# EasyEDA Pro project 包裹款-触摸屏控制板V1.3.eprj, board PCB
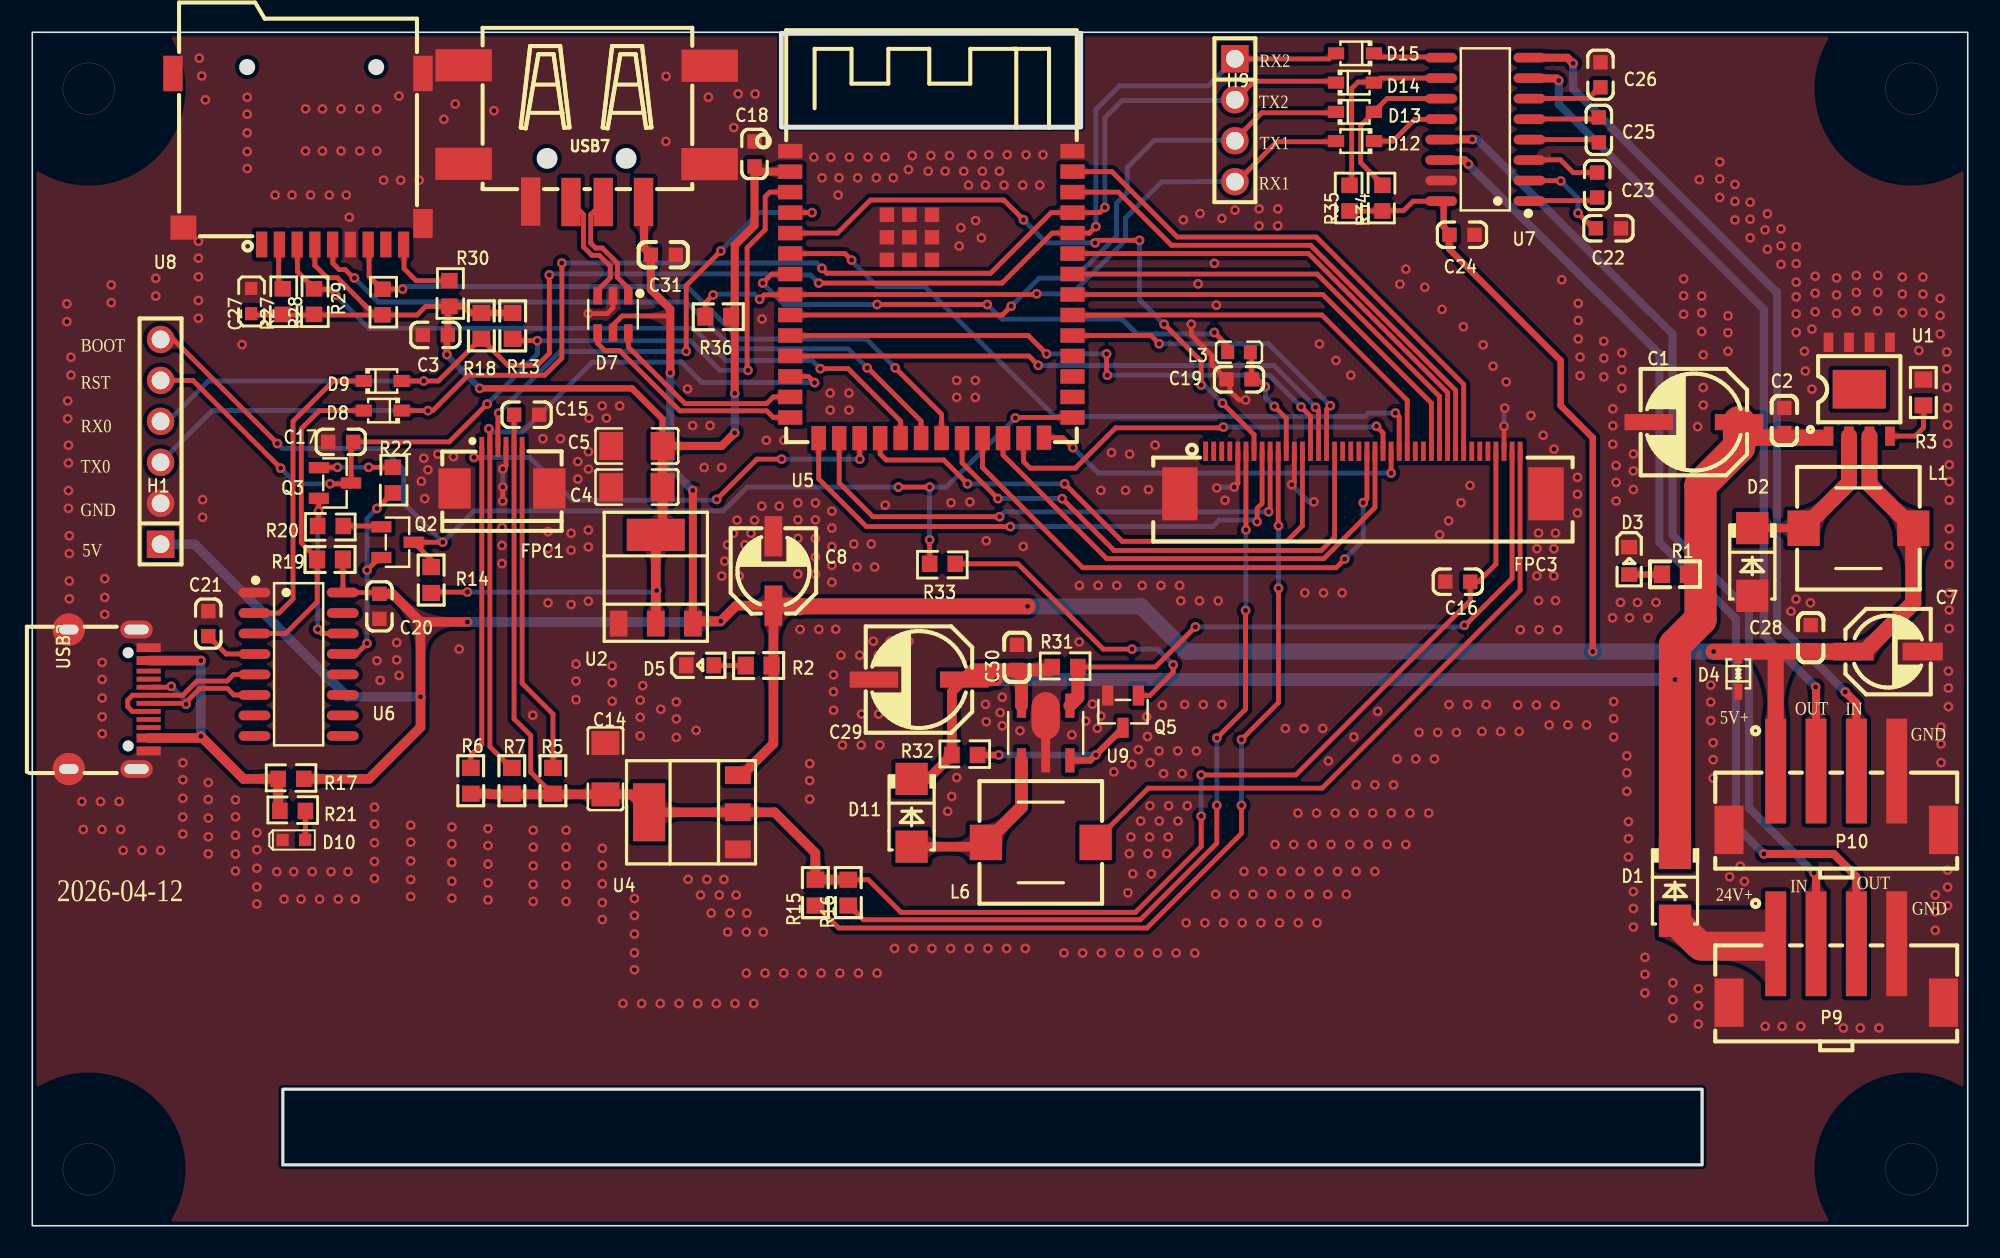
[diagram p1: board, top side]
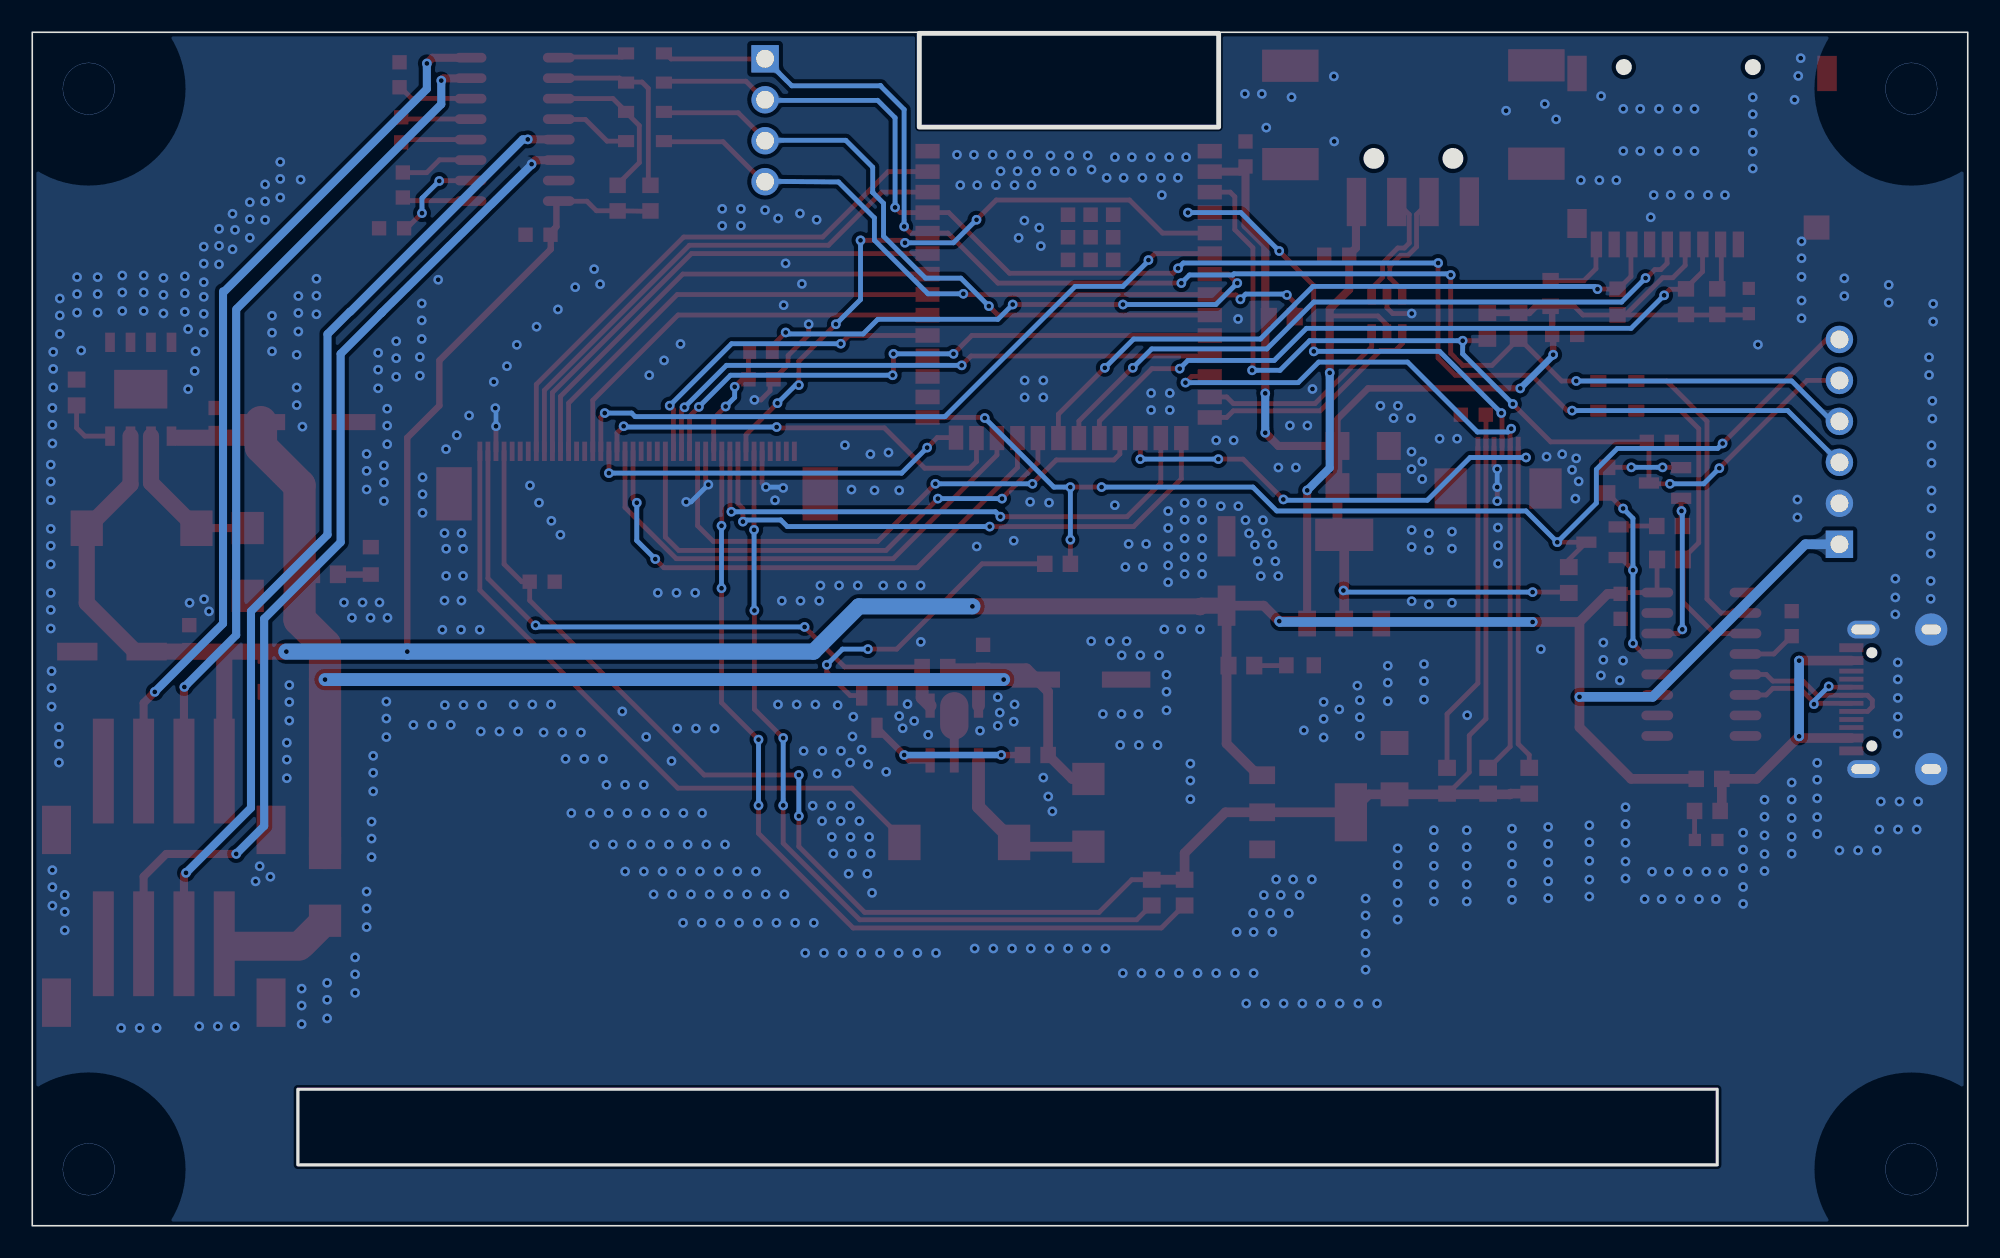
[diagram p2: board, bottom side, seen from below]

Outline 120 x 74 mm; copper layers: Top Layer, Bottom Layer. Coordinates in mm from the lower left corner of the outline.
Outline path: rectangle 0,74 120,0 ; circle c3.5,70.5 r1.6 ; circle c3.5,3.5 r1.6 ; rectangle 15.53,8.47 103.53,3.77 ; rectangle 46.44,73.93 65.01,68.12 ; circle c116.5,70.5 r1.6 ; circle c116.5,3.5 r1.6
Stack: Top Layer 0.035mm / Dielectric1 1.51mm FR4 er 4.5 / Bottom Layer 0.035mm

## Design rules (mm)
net SL_D+: DP3
net SL_D-: DP3
net USB_D+: DP1
net USB_D-: DP1
net D1-: DP2
net D1+: DP2
template: 用户自定义配置
spacing Default (default): track to track 0.152, other pairs 0 to 0.152
track width Default (default): min 0.254, default 0.254, max 25.4
differential pair differentialPair (default): width min 0.127, default 0.254, max 2.54; gap min 0.152, default 0.152
via Default (default): diameter min 0.25, default 0.61, max 100.025; hole min 0.2, default 0.305, max 59.995

## Placement (name value [footprint] x y rotation side)
C1  100uF/35V  [电解电容贴片6X6]  103.02 49.83 180 top
C2  104  [0603C]  108.63 49.93 270 top
C3  104  [0603C]  24.99 55.23 0 top
C4  4.7uF  [C1206]  37.49 45.8 0 top
C5  4.7uF  [C1206]  37.49 48.35 0 top
C7  100uF/10V  [CAP-SMD_BD5.0-L5.3-W5.3-RD]  115.06 35.6 180 top
C8  100uF/10V  [CAP-SMD_BD5.0-L5.3-W5.3-RD]  45.95 40.6 270 top
C14  4.7uF  [C1206]  35.54 28.34 270 top
C15  104  [0603C]  30.65 50.29 180 top
C16  104  [0603C]  88.38 39.93 0 top
C17  104  [0603C]  19.12 48.6 0 top
C18  104  [0603C]  44.78 66.45 270 top
C19  10pF  [0603C]  74.82 52.48 0 top
C20  104  [0603C]  21.52 38.4 270 top
C21  104  [0603C]  10.91 37.33 90 top
C22  104  [0603C]  97.72 61.85 180 top
C23  104  [0603C]  97.02 64.53 270 top
C24  104  [0603C]  88.64 61.45 180 top
C25  104  [0603C]  97.13 67.95 270 top
C26  104  [0603C]  97.23 71.36 90 top
C27  104  [11]  13.87 58.08 90 top
C28  104  [0603C]  110.26 36.47 90 top
C29  100uF/35V  [电解电容贴片6X6]  54.98 33.86 180 top
C30  104  [0603C]  61.05 35.24 90 top
C31  104  [0603C]  39.12 60.21 0 top
D1  SS56  [SMA]  101.85 21.01 270 top
D2  SS56  [SMA]  106.64 41.16 270 top
D3  绿光  [0603LED]  98.99 41.26 90 top
D4  PESD5V0L1BA-N  [SOD-323_L1.8-W1.3-LS2.5-BI]  105.77 34.22 90 top
D5  绿光  [0603LED]  41.36 34.73 180 top
D7  USBLC6-2SC6  [SOT-23-6_L2.9-W1.6-P0.95-LS2.8-BL]  36.01 56.51 180 top
D8  1N4148WS  [SOD-323_L1.8-W1.3-LS2.5-RD]  21.73 50.54 180 top
D9  1N4148WS  [SOD-323_L1.8-W1.3-LS2.5-RD]  21.73 52.38 0 top
D10  LED红  [0603L]  16.22 23.92 180 top
D11  SS56  [SMA]  54.52 25.6 270 top
D12  1N4148WS  [SOD-323_L1.8-W1.3-LS2.5-RD]  82.01 67.25 180 top
D13  1N4148WS  [SOD-323_L1.8-W1.3-LS2.5-RD]  82.01 69.06 0 top
D14  1N4148WS  [SOD-323_L1.8-W1.3-LS2.5-RD]  82.01 70.88 0 top
D15  1N4148WS  [SOD-323_L1.8-W1.3-LS2.5-RD]  82.01 72.69 180 top
FPC1  FPC-05F-6PH20(0.5)  [FPC-SMD_6P-P0.50_XUNPU_FPC-05F-6PH20]  29.12 47 0 top
FPC3  AFC07-S40ECA-00  [FPC-SMD_P0.50-40P_LCS-SJ-H2.0]  82.5 46.7 180 top
H1  PZ254V-11-06P  [HDR-TH_6P-P2.54-V-M]  7.96 48.6 90 top
H9  PZ254V-11-04P  [HDR-TH_4P-P2.54-V-M]  74.56 68.55 270 top
L1  68uH  [IND-SMD_L7.0-W7.0_SMDRI74-330MT]  113.22 43.25 180 top
L3  10uH  [L0603]  74.82 54.16 180 top
L6  68uH  [IND-SMD_L7.0-W7.0_SMDRI74-330MT]  62.53 23.77 0 top
P9  2.54-4PLTDK  [CONN-SMD_4P-P2.50_SHOU_2.54-4PLTDK]  111.84 15.66 0 top
P10  2.54-4PLTDK  [CONN-SMD_4P-P2.50_SHOU_2.54-4PLTDK]  111.84 26.37 0 top
Q2  SS8050  [SOT-23-3_L2.9-W1.3-P1.90-LS2.4-BR]  22.64 42.38 180 top
Q3  SS8050  [SOT-23-3_L2.9-W1.3-P1.90-LS2.4-BR]  18.77 46.05 180 top
Q5  SS8050  [SOT-23-3_L2.9-W1.3-P1.90-LS2.4-BR]  67.63 31.88 90 top
R1  47K  [0603R]  101.85 40.39 0 top
R2  10K  [0603R]  45.03 34.73 0 top
R3  10K  [0603R]  117.25 51.66 90 top
R5  10K  [0603R]  32.28 27.59 90 top
R6  10K  [0603R]  27.19 27.59 90 top
R7  10K  [0603R]  29.74 27.59 90 top
R13  10K  [0603R]  29.78 55.79 270 top
R14  10K  [0603R]  24.73 40.04 90 top
R15  10K  [0603R]  48.55 20.66 270 top
R16  10K  [0603R]  50.59 20.66 270 top
R17  0Ω  [10]  15.15 27.59 0 top
R18  10K  [0603R]  27.85 55.79 90 top
R19  10K  [0603R]  18.46 41.31 180 top
R20  10K  [10]  19.38 43.5 180 top
R21  10K  [10]  15.25 25.6 0 top
R22  10K  [10]  22.24 47.12 270 top
R27  10K  [10]  15.41 58.19 270 top
R28  10K  [10]  17.35 58.19 270 top
R29  10K  [10]  21.6 58.17 270 top
R30  10K  [10]  25.75 58.7 270 top
R31  1K  [10]  63.14 34.53 0 top
R32  51K  [10]  56.92 29.07 0 top
R33  1K  [10]  57.32 41.16 180 top
R34  10K  [10]  83.82 62.82 90 top
R35  10K  [10]  81.79 62.82 90 top
R36  10K  [0603R]  42.53 56.36 180 top
U1  XL1509-5.0E1//SXL1509-5.0E1  [ESOP-8_L4.9-W3.9-P1.27-LS6.0-BL-EP]  113.27 51.87 0 top
U2  1117-3.3  [SOT-223]  38.66 40.04 0 top
U4  1117-3.3  [SOT-223]  41.05 25.64 90 top
U5  ESPS3-32-WROOM-1-N16R8  [WIRELM-SMD_ESP32-S3-WROOM-2-N32R8V]  55.74 57.73 0 top
U6  CH340C  [SOIC-16_L9.9-W3.9-P1.27-LS6.0-BL]  16.51 34.82 270 top
U7  SP3232EEN-L/TR  [SOIC-16_L9.9-W3.9-P1.27-LS6.0-BL]  90.09 67.98 90 top
U8  自弹TF卡座TFAA  [SIM-SMD_C9900015645]  16.47 66.14 180 top
U9  PT4115  [SOT-89-5_L4.5-W2.5-P1.50-LS4.5-BR]  62.83 30.55 270 top
USB2  TYPE-C 16PIN  [USB-C-SMD_TYPE-C-6PIN+]  4.64 32.64 270 top
USB7  AF 10.0 QT-ZB6.8  [USB-A-SMD_AF-10.0-QT-ZB6.8]  34.37 67.71 180 top

## Footprints (pads in the part's own frame, mm; a bottom-side part is the same pattern mirrored in y, then rotated)
10
  rect 0.965x1.016 smd: 1(0.101,0.117) 2(1.688,0.117)
11
  rect 0.813x0.762 smd: 1(0.043,0.296) 2(-1.524,0.301)
0603C
  rect 0.889x0.889 smd: 1(-0.774,0) 2(0.774,0)
0603L
  rect 0.762x0.762 smd: 1(-0.699,0) 2(0.699,0)
0603LED
  rect 0.9x1 smd: 1(-0.884,-0.017) 2(0.816,-0.017)
0603R
  rect 1x1.1 smd: 1(-0.8,0) 2(0.8,0)
C1206
  rect 1.485x1.728 smd: 1(-1.593,0) 2(1.593,0)
CAP-SMD_BD5.0-L5.3-W5.3-RD
  rect 2.5x1.1 smd: 1(2.15,0) 2(-2.15,0)
CONN-SMD_4P-P2.50_SHOU_2.54-4PLTDK
  rect 1.3x6.5 smd: 1(-3.75,1.825) 2(-1.25,1.825) 3(1.25,1.825) 4(3.75,1.825)
  rect 1.8x3 smd: 5(6.65,-1.825) 6(-6.65,-1.825)
ESOP-8_L4.9-W3.9-P1.27-LS6.0-BL-EP
  rect 0.6x1.2 smd: 1(-1.905,-2.909) 2(-0.635,-2.909) 3(0.635,-2.909) 4(1.905,-2.909) 5(1.905,2.909) 6(0.635,2.909) 7(-0.635,2.909) 8(-1.905,2.909)
  rect 3.3x2.4 smd: 9(0,0)
FPC-SMD_6P-P0.50_XUNPU_FPC-05F-6PH20
  rect 0.3x1.25 smd: 1(-1.25,1.288) 2(-0.75,1.288) 3(-0.25,1.288) 4(0.25,1.288) 5(0.75,1.288) 6(1.25,1.288)
  rect 2x2.5 smd: 7(2.94,-1.288) 8(-2.94,-1.288)
FPC-SMD_P0.50-40P_LCS-SJ-H2.0
  rect 0.3x1.2 smd: 1(9.751,-1.318) 2(9.252,-1.318) 3(8.753,-1.318) 4(8.252,-1.318) 5(7.752,-1.318) 6(7.252,-1.318) 7(6.752,-1.318) 8(6.251,-1.318) 9(5.753,-1.318) 10(5.253,-1.318) 11(4.753,-1.318) 12(4.252,-1.318) 13(3.752,-1.318) 14(3.251,-1.318) 15(2.752,-1.318) 16(2.253,-1.318) 17(1.752,-1.318) 18(1.252,-1.318) 19(0.752,-1.318) 20(0.252,-1.318) 21(-0.249,-1.318) 22(-0.748,-1.318) 23(-1.247,-1.318) 24(-1.748,-1.318) 25(-2.248,-1.318) 26(-2.748,-1.318) 27(-3.248,-1.318) 28(-3.749,-1.318) 29(-4.247,-1.318) 30(-4.747,-1.318) 31(-5.247,-1.318) 32(-5.748,-1.318) 33(-6.248,-1.318) 34(-6.749,-1.318) 35(-7.248,-1.318) 36(-7.747,-1.318) 37(-8.248,-1.318) 38(-8.748,-1.318) 39(-9.248,-1.318) 40(-9.748,-1.318)
  rect 2.2x3.3 smd: 41(11.35,1.318) 42(-11.35,1.318)
HDR-TH_4P-P2.54-V-M
  rect 1.7x1.7 hole 1.1: 1(-3.81,0)
  round 1.7 hole 1.1: 2(-1.27,0) 3(1.27,0) 4(3.81,0)
HDR-TH_6P-P2.54-V-M
  rect 1.7x1.7 hole 1.1: 1(-6.35,0)
  round 1.7 hole 1.1: 2(-3.81,0) 3(-1.27,0) 4(1.27,0) 5(3.81,0) 6(6.35,0)
IND-SMD_L7.0-W7.0_SMDRI74-330MT
  rect 2x2.2 smd: 1(-3.4,0) 2(3.4,0)
L0603
  rect 0.8x0.864 smd: 1(-0.7,0) 2(0.7,0)
SIM-SMD_C9900015645
  rect 0.7x1.6 smd: 1(2.25,5.3) 2(1.15,5.3) 3(0.05,5.3) 4(-1.05,5.3) 5(-2.15,5.3) 6(-3.25,5.3) 7(-4.35,5.3) 8(-5.45,5.3) 9(-6.55,5.3)
  rect 1.2x1.8 smd: 10(-7.75,4)
  rect 1.6x1.5 smd: 11(7.1,4.25)
  rect 1.2x2.2 smd: 12(-7.75,-5.3) 13(7.75,-5.3)
SMA
  rect 2x2 smd: 1(2.1,0) 2(-2.1,0)
SOD-323_L1.8-W1.3-LS2.5-BI
  rect 0.986x0.49 smd: 1(-1.117,0) 2(1.117,0)
SOD-323_L1.8-W1.3-LS2.5-RD
  rect 1x0.75 smd: 1(-1.173,0) 2(1.173,0)
SOIC-16_L9.9-W3.9-P1.27-LS6.0-BL
  oval 0.602x1.971 smd: 1(-4.445,-2.736) 2(-3.175,-2.736) 3(-1.905,-2.736) 4(-0.635,-2.736) 5(0.635,-2.736) 6(1.905,-2.736) 7(3.175,-2.736) 8(4.445,-2.736) 9(4.445,2.736) 10(3.175,2.736) 11(1.905,2.736) 12(0.635,2.736) 13(-0.635,2.736) 14(-1.905,2.736) 15(-3.175,2.736) 16(-4.445,2.736)
SOT-23-3_L2.9-W1.3-P1.90-LS2.4-BR
  rect 1.25x0.7 smd: 1(1,-0.95) 2(1,0.95) 3(-1,0)
SOT-23-6_L2.9-W1.6-P0.95-LS2.8-BL
  rect 0.532x1.072 smd: 1(-0.95,-1.149) 2(0,-1.149) 3(0.95,-1.149) 4(0.95,1.149) 5(0,1.149) 6(-0.95,1.149)
SOT-89-5_L4.5-W2.5-P1.50-LS4.5-BR
  rect 1.5x0.574 smd: 1(1.698,-1.5) 3(1.698,1.5) 4(-1.698,1.5) 5(-1.698,-1.5)
  oval 2.94x1.76 smd: 2(-1.067,0)
  rect 2.209x0.552 smd: 2(1.343,0)
SOT-223
  rect 1.1x1.6 smd: 1(-2.3,-2.7) 2(0,-2.7) 3(2.3,-2.7)
  rect 3.6x2 smd: 4(0,2.8)
USB-A-SMD_AF-10.0-QT-ZB6.8
  rect 1.2x3 smd: 1(-3.528,4.237) 2(-1.028,4.237) 3(0.972,4.237) 4(3.472,4.213)
  rect 3.5x2 smd: 5(-7.628,-4.213) 5(-7.622,1.887) 5(7.628,1.863) 5(7.628,-4.237)
USB-C-SMD_TYPE-C-6PIN+
  rect 0.55x1.5 smd: 1(-3.2,2.575) 2(-2.4,2.575) 11(2.4,2.575) 12(3.2,2.575)
  rect 0.3x1.5 smd: 3(-1.75,2.575) 4(-1.25,2.575) 5(-0.75,2.575) 6(-0.25,2.575) 7(0.25,2.575) 8(0.75,2.575) 9(1.25,2.575) 10(1.75,2.575)
  oval 1.1x2 hole 0.6x1.5: 13(-4.325,1.825) 14(4.325,1.825)
  oval 2x2 hole 0.6x1.2: 13(-4.325,-2.375) 14(4.325,-2.375)
WIRELM-SMD_ESP32-S3-WROOM-2-N32R8V
  rect 1.5x0.9 smd: 1(-8.75,8.895) 2(-8.75,7.625) 3(-8.75,6.355) 4(-8.75,5.085) 5(-8.75,3.815) 6(-8.75,2.545) 7(-8.75,1.275) 8(-8.75,0.005) 9(-8.75,-1.265) 10(-8.75,-2.535) 11(-8.75,-3.805) 12(-8.75,-5.075) 13(-8.75,-6.345) 14(-8.75,-7.615) 27(8.75,-7.615) 28(8.75,-6.345) 29(8.75,-5.075) 30(8.75,-3.805) 31(8.75,-2.535) 32(8.75,-1.265) 33(8.75,0.005) 34(8.75,1.275) 35(8.75,2.545) 36(8.75,3.815) 37(8.75,5.085) 38(8.75,6.355) 39(8.75,7.625) 40(8.75,8.895)
  rect 0.9x1.5 smd: 15(-6.985,-8.895) 16(-5.715,-8.895) 17(-4.445,-8.895) 18(-3.175,-8.895) 19(-1.905,-8.895) 20(-0.635,-8.895) 21(0.635,-8.895) 22(1.905,-8.895) 23(3.175,-8.895) 24(4.445,-8.895) 25(5.715,-8.895) 26(6.985,-8.865)
  rect 0.9x0.9 smd: 41(-2.76,4.955) 41(-2.76,3.555) 41(-2.76,2.155) 41(-1.36,4.955) 41(-1.36,3.555) 41(-1.36,2.155) 41(0.04,4.955) 41(0.04,3.555) 41(0.04,2.155)
电解电容贴片6X6
  rect 3x1 smd: 1(-2.8,0) 2(2.8,0)

## Nets
As in the schematic.

Pads without a net: FPC3 1 2 3 4 18 19 20 27 28 34 35 36; U1 9; U5 28 29 30; U6 7 8 9 10 11 12 15; U8 1 8; USB2 3 9

## Via types
v1: diameter 0.6, hole 0.3, Top Layer to Bottom Layer, 819 vias

## Routing (per net, layer and track width the routed paths; a pad name or vN(x,y) marks a point on that pad's centre or on a via; arc(x,y) is an arc through that point)
3V3: length 92.1
  Top Layer w0.3: v1(26.98,39.29) 24.79,39.29 R14.1 ; 17.62,60.72 17.55,60.79 ; 17.52,60.84 17.52,60.79 ; 17.52,60.79 17.51,60.79 ; 17.52,60.79 17.52,59.54 18.28,58.78 18.91,58.78 21.18,56.51 ; 13.57,56.48 13.58,56.47 23.86,56.47 24.39,57 25.85,57
  Top Layer w0.4: C5.2 39.08,50.02 37.18,51.92 v1(27.74,51.92) ; R13.1 R18.2 27.19,56.59 26.77,57.01 R30.2 25.85,57 25.77,56.91 25.77,55.23 25.7,55.17 v1(25.7,54.01)
  Top Layer w0.5: v1(43.55,49.16) 42.74,48.35 C5.2 ; U5.2 45.1,65.36 44.78,65.68 44.78,62.02 43.55,60.79 v1(43.55,51.61)
  Top Layer w0.6: U2.2 U2.4 39.08,43.26 C4.2 C5.2
  Bottom Layer w0.3: v1(26.98,39.29) 38.61,39.29 v1(38.71,39.39)
  Bottom Layer w0.4: v1(25.7,54.01) 25.7,53.96 v1(27.74,51.92)
  Bottom Layer w0.5: v1(43.55,49.16) v1(43.55,51.61)
3V3_CM: length 111.3
  Top Layer w0.3: 32.23,26.79 30.91,28.12 30.91,30.4 29.87,31.43 FPC1.5 29.87,50.28 C15.2 ; FPC3.37 90.75,41.02 89.66,39.93 C16.2 89.16,38.77 78.34,27.95 v1(72.47,27.95) ; v1(72.47,25.4) 72.47,23.51 68.39,19.43 53.86,19.43 51.83,21.46 R16.1
  Top Layer w0.6: R6.1 28.34,26.79 28.38,26.75 C14.2 37.14,26.75 U4.4 U4.2 46.02,25.64 48.55,23.1 R15.1 R16.1
  Bottom Layer w0.3: v1(72.47,27.95) v1(72.47,25.4)
5V_SHAOLU: length 19.1
  Top Layer w0.6: USB2.11 10.35,30.24 v1(10.45,30.35) 13.09,27.71 R17.1 15.25,25.82 R21.1 ; USB2.2 v1(10.45,35.04)
  Bottom Layer w0.6: v1(10.45,35.04) v1(10.45,30.35)
5V_VCC: length 239.6
  Top Layer w0.3: 39.55,56.45 39.5,56.41 36.57,56.41 ; C20.1 21.44,39.26 19.25,39.26 19.26,39.27 R19.1 ; 83.76,62.93 81.68,62.9 81.66,62.92 ; 83.76,62.93 85.02,62.93 85.61,63.52 87.32,63.52 ; 83.76,62.93 83.68,62.93 ; 36.57,56.41 36.01,55.85 D7.5
  Top Layer w0.4: 87.5,63.49 87.5,61.95 87.62,61.83 87.88,61.53 ; 94.76,53.65 94.76,50.85 96.75,48.86 v1(96.75,35.6) ; 87.85,61.42 87.85,60.55 94.74,53.66
  Top Layer w0.5: v1(39.56,52.89) 39.56,56.83 38.35,58.04 38.35,60.15 ; 37.93,63.44 37.93,60.63 38.33,60.22 ; v1(40.95,45.59) 40.96,45.59 U2.3
  Top Layer w0.6: 24.07,37.43 v1(24.07,32.79) 24.07,30.91 20.87,27.71 R17.2 ; 24.07,37.43 22.33,39.18 C20.1 ; 24.07,37.43 v1(26.98,37.43) ; U2.3 41.11,37.49 v1(42.69,37.49) 43.65,38.45 C8.1 45.95,29.89 44,27.94 U4.3
  Top Layer w1: 107.93,35.6 108.09,35.44 P10.1 ; 107.93,35.6 v1(104.24,35.6) ; 107.93,35.6 C7.1 113.61,35.6 116.62,38.61 L1.1 113.91,45.96 113.91,48.96 ; C8.1 47.5,38.45 47.59,38.35 47.65,38.4 v1(61.71,38.4)
  Bottom Layer w0.5: v1(39.56,52.89) 39.56,46.99 v1(40.95,45.59)
  Bottom Layer w0.6: v1(42.69,37.49) 42.64,37.43 v1(26.98,37.43) ; H1.1 10.07,42.25 19.53,32.79 v1(24.07,32.79)
  Bottom Layer w1: v1(61.71,38.4) 68.75,38.4 71.55,35.6 v1(96.75,35.6) v1(104.24,35.6)
24V_D1: length 94.2
  Top Layer w0.6: C29.1 57.02,33.1 R32.1 55.53,27.7 D11.2
  Top Layer w0.8: U9.5 61.33,34.18 C30.1 ; C30.1 58.38,34.47 C29.1 v1(59.77,33.86) ; C30.1 63.06,34.47 R31.1
  Top Layer w1: 110.98,48.86 106.79,48.86 C1.1
  Top Layer w2: C1.1 105.82,48.29 103.43,45.9 103.43,37.59 101.85,36.01 v1(101.85,33.86) D1.2
  Bottom Layer w0.8: v1(59.77,33.86) v1(101.85,33.86)
GND: length 22.2
  Top Layer w0.3: FPC3.38 v1(91.25,49.57) ; FPC1.4 29.37,47.12 v1(29.17,46.92) ; v1(34.48,56.56) 35.65,56.56 36.01,56.92 D7.2 ; FPC3.12 78.25,46.12 v1(78.08,45.95) ; v1(74.51,45.8) 74.75,46.03 FPC3.5 ; v1(75.23,51.2) 74.82,51.2 74.26,51.77 74.26,52.27 C19.1 73.14,53.39 73.14,53.96 71.86,55.23 v1(71.86,55.9) ; v1(29.17,45.8) v1(29.17,44.93)
  Bottom Layer w0.3: v1(91.25,49.57) 91.25,50.65 v1(91.29,50.69) ; v1(78.08,45.95) 79.15,44.88 v1(79.46,44.88) ; v1(74.51,45.8) 73.49,45.8 v1(73.44,45.75) ; v1(29.17,46.92) v1(29.17,45.8)
  vias: v1(2.14,57.16) v1(2.14,56.06) v1(2.19,51.14) v1(2.19,50.04) v1(2.25,48.39) v1(2.25,47.29) v1(2.25,45.59) v1(2.25,44.48) v1(2.3,42.78) v1(2.3,41.68) v1(2.3,39.98) v1(2.3,38.87) v1(2.4,53.85) v1(2.4,52.75) v1(3.07,26.3) v1(3.17,24.57) v1(4.23,26.3) v1(4.34,34.93) v1(4.34,33.88) v1(4.34,32.72) v1(4.34,31.56) v1(4.34,30.51) v1(4.32,24.57) v1(4.49,40.12) v1(4.49,38.96) v1(4.49,37.91) v1(4.9,58.34) v1(4.9,57.23) v1(5.39,26.3) v1(5.48,24.57) v1(5.64,23.27) v1(6.8,23.27) v1(7.65,58.74) v1(7.65,57.64) v1(7.96,23.27) v1(9.34,28.7) v1(9.34,27.65) v1(9.34,26.5) v1(9.34,25.34) v1(9.34,24.29) v1(10.36,72.39) v1(10.3,61.04) v1(10.3,59.99) v1(10.3,58.84) v1(10.3,57.37) v1(10.3,56.27) v1(10.51,71.29) v1(10.56,45.02) v1(10.56,43.92) v1(10.74,69.81) v1(10.92,27.48) v1(10.92,26.43) v1(10.92,25.28) v1(10.92,24.12) v1(10.92,23.07) v1(12.6,26.41) v1(12.6,25.36) v1(12.6,24.21) v1(12.6,23.05) v1(12.6,21.99) v1(13.01,54.63) v1(13.33,69.97) v1(13.33,68.92) v1(13.33,67.76) v1(13.33,66.6) v1(13.33,65.55) v1(13.93,24.37) v1(13.93,23.32) v1(13.93,22.17) v1(13.93,21.01) v1(13.93,19.95) v1(15.05,63.91) v1(15.16,21.95) v1(15.61,20.25) v1(16.11,63.91) v1(16.21,21.95) v1(16.67,20.25) v1(16.94,69.25) v1(16.94,66.64) v1(17.26,63.91) v1(17.36,21.95) v1(17.82,20.25) v1(17.99,69.25) v1(17.99,66.64) v1(18.42,63.91) v1(18.52,21.95) v1(18.98,20.25) v1(19.14,69.25) v1(19.14,66.64) v1(19.47,63.91) v1(19.57,21.95) v1(19.66,62.53) v1(20.03,20.25) v1(20.31,69.25) v1(20.31,66.64) v1(21.22,25.95) v1(21.22,24.9) v1(21.22,23.75) v1(21.22,22.59) v1(21.22,21.54) v1(21.36,69.25) v1(21.36,66.64) v1(21.37,35.04) v1(21.57,33.81) v1(21.79,64.82) v1(22.59,36.16) v1(22.59,35.09) v1(22.73,70.04) v1(22.75,34.12) v1(22.84,64.82) v1(23.46,24.83) v1(23.46,23.78) v1(23.46,22.63) v1(23.46,21.46) v1(23.46,20.41) v1(23.99,64.82) v1(24.12,46.16) v1(24.28,47.58) v1(24.33,45.08) v1(24.53,46.87) v1(25.14,47.84) v1(25.52,68.6) v1(26.01,24.73) v1(26.01,23.68) v1(26.01,22.52) v1(26.01,21.36) v1(26.01,20.31) v1(26.11,47.69) v1(26.22,69.55) v1(26.47,35.75) v1(28.26,24.62) v1(28.26,23.57) v1(28.26,22.42) v1(28.26,21.26) v1(28.26,20.21) v1(28.62,69.14) v1(29.13,43.29) v1(29.12,42.18) v1(29.12,41.06) v1(31.03,31.65) v1(31.06,24.52) v1(31.06,23.47) v1(31.06,22.32) v1(31.06,21.16) v1(31.06,20.11) v1(31.66,48.8) v1(31.98,43.04) v1(31.98,41.98) v1(31.98,38.62) v1(32.74,48.8) v1(33.1,24.52) v1(33.1,23.47) v1(33.1,22.32) v1(33.1,21.16) v1(33.1,20.11) v1(33.41,42.93) v1(33.41,41.88) v1(33.41,38.52) v1(33.71,34.82) v1(33.71,33.77) v1(33.71,32.62) v1(33.82,47.38) v1(33.82,46.3) v1(34.48,43.14) v1(34.48,42.09) v1(34.48,38.72) v1(34.52,50.07) v1(34.49,47.99) v1(34.49,46.91) v1(35.33,50.84) v1(35.35,23.4) v1(35.35,22.35) v1(35.35,21.2) v1(35.35,20.04) v1(35.35,18.99) v1(35.6,50.07) v1(35.96,34.72) v1(35.96,33.67) v1(35.96,32.52) v1(36.42,50.84) v1(36.62,13.78) v1(37.33,20.29) v1(37.33,19.24) v1(37.33,18.09) v1(37.33,16.92) v1(37.33,15.87) v1(37.69,32.58) v1(37.69,31.53) v1(37.69,30.38) v1(37.78,13.78) v1(37.84,33.49) v1(38.97,32.02) v1(38.94,13.78) v1(39.28,67.23) v1(39.3,71.26) v1(39.94,32.48) v1(39.94,31.43) v1(39.94,30.28) v1(40.1,13.78) v1(40.63,51.88) v1(40.67,21.47) v1(40.94,49.61) v1(41.16,30.71) v1(41.26,13.78) v1(41.43,20.5) v1(41.66,47.01) v1(41.83,21.47) v1(41.92,69.97) v1(42.03,49.61) v1(42.09,19.38) v1(42.41,13.78) v1(42.59,20.5) v1(42.74,47.01) v1(42.75,40.28) v1(42.88,21.47) v1(42.93,41.2) v1(43.11,42.22) v1(43.11,18.21) v1(43.26,19.38) v1(43.47,42.93) v1(43.49,68.09) v1(43.57,13.78) v1(43.64,20.5) v1(43.77,70.18) v1(43.7,43.75) v1(43.83,40.28) v1(44.02,41.2) v1(44.19,42.22) v1(44.28,18.21) v1(44.28,15.66) v1(44.31,19.38) v1(44.56,42.93) v1(44.78,43.75) v1(44.73,13.78) v1(44.82,70.18) v1(45.24,56.22) v1(45.23,44.62) v1(45.33,18.21) v1(45.43,15.66) v1(45.51,48.7) v1(46.31,44.62) v1(46.6,48.7) v1(46.59,15.66) v1(47.47,44.82) v1(47.47,43.77) v1(47.47,42.62) v1(47.47,41.46) v1(47.47,40.41) v1(47.6,36.98) v1(47.75,15.66) v1(48.2,28.65) v1(48.2,27.6) v1(48.2,26.45) v1(48.46,66.25) v1(48.55,44.82) v1(48.55,43.77) v1(48.55,42.62) v1(48.55,41.46) v1(48.55,40.41) v1(48.76,36.98) v1(48.97,64.98) v1(48.91,15.66) v1(49.47,51.63) v1(49.47,50.58) v1(49.51,66.25) v1(49.58,44.31) v1(49.58,43.26) v1(49.58,42.11) v1(49.58,40.95) v1(49.58,39.9) v1(49.68,34.16) v1(49.68,33.11) v1(49.68,31.96) v1(49.81,36.98) v1(49.97,63.91) v1(50.02,64.98) v1(50.07,15.66) v1(50.14,35.37) v1(50.23,29.8) v1(50.66,66.25) v1(50.63,51.63) v1(50.63,50.58) v1(50.94,42.27) v1(51.17,64.98) v1(51.14,40.84) v1(51.23,15.66) v1(51.3,35.37) v1(51.42,31.73) v1(51.39,29.8) v1(51.82,66.25) v1(52.02,42.27) v1(52.15,36.24) v1(52.23,40.84) v1(52.33,64.98) v1(52.46,35.37) v1(52.47,31.73) v1(52.39,15.66) v1(52.55,29.8) v1(52.87,66.25) v1(52.88,44.68) v1(53.2,36.24) v1(53.39,64.98) v1(53.46,17.19) v1(53.62,31.73) v1(54.32,65.49) v1(54.35,36.24) v1(54.56,66.35) v1(54.62,17.19) v1(55.55,65.39) v1(55.71,66.35) v1(55.78,17.19) v1(56.6,65.39) v1(56.75,25.7) v1(56.87,66.35) v1(56.96,44.83) v1(56.94,17.19) v1(57.01,26.61) v1(57.31,52.41) v1(57.31,51.36) v1(57.31,27.79) v1(57.47,60.74) v1(57.57,61.89) v1(57.75,65.39) v1(58.05,64.52) v1(58.13,44.88) v1(58.09,17.19) v1(58.25,66.41) v1(58.47,52.41) v1(58.47,51.36) v1(58.49,62.32) v1(58.85,61.25) v1(58.91,65.39) v1(59.1,64.52) v1(59.15,42.47) v1(59.1,32.33) v1(59.15,31.25) v1(59.25,17.19) v1(59.3,66.41) v1(59.96,65.39) v1(60.02,31.82) v1(60.14,32.77) v1(60.14,31) v1(60.25,64.52) v1(60.45,66.41) v1(60.41,17.19) v1(61.24,30.69) v1(61.41,64.52) v1(61.44,42.12) v1(61.57,17.19) v1(61.62,66.41) v1(62.46,64.52) v1(62.67,66.41) v1(63.97,16.91) v1(64.45,30.44) v1(64.92,39.7) v1(64.91,36.2) v1(65.12,16.91) v1(65.32,31.3) v1(65.73,32.34) v1(66.08,39.7) v1(66.03,30.85) v1(66.25,45.59) v1(66.25,31.6) v1(66.28,16.91) v1(66.91,47.94) v1(67.05,28.14) v1(67.24,39.7) v1(67.44,16.91) v1(67.78,45.59) v1(67.93,20.64) v1(68.03,47.84) v1(68.02,23.07) v1(68.18,28.6) v1(68.11,24.11) v1(68.23,21.82) v1(68.58,29.52) v1(68.6,16.91) v1(68.72,25.09) v1(68.82,39.7) v1(69.09,31.56) v1(69.14,30.34) v1(69.18,23.07) v1(69.21,45.65) v1(69.27,24.11) v1(69.3,28.71) v1(69.3,26.04) v1(69.39,21.82) v1(69.62,48.4) v1(69.76,16.91) v1(69.86,29.44) v1(69.88,25.09) v1(69.98,39.7) v1(70.06,32.27) v1(70.14,28.04) v1(70.33,23.07) v1(70.45,26.04) v1(70.43,24.11) v1(70.92,16.91) v1(71.02,29.44) v1(71.03,25.09) v1(71.13,39.7) v1(71.21,38.75) v1(71.37,62.37) v1(71.3,28.04) v1(71.45,32.32) v1(71.54,18.78) v1(71.61,26.04) v1(72.08,16.91) v1(72.18,29.44) v1(72.28,58.4) v1(72.37,38.75) v1(72.4,62.76) v1(72.6,32.32) v1(72.7,18.78) v1(73.3,59.67) v1(73.37,20.55) v1(73.41,57.08) v1(73.53,38.75) v1(73.76,62.46) v1(73.76,32.32) v1(73.86,18.78) v1(73.95,44.98) v1(74.57,62.97) v1(74.53,20.55) v1(75.02,18.78) v1(75.13,21.97) v1(75.68,20.55) v1(76.06,63.05) v1(76.06,62) v1(76.18,18.78) v1(76.29,21.97) v1(76.84,20.55) v1(77.05,23.64) v1(77.22,63.05) v1(77.22,62) v1(77.34,18.78) v1(77.45,21.97) v1(77.69,30.83) v1(78,20.55) v1(78.21,23.64) v1(78.47,25.59) v1(78.49,18.78) v1(78.61,21.97) v1(78.85,30.83) v1(78.9,39.24) v1(79.16,20.55) v1(79.36,23.64) v1(79.63,25.59) v1(79.65,18.78) v1(79.76,21.97) v1(79.81,54.67) v1(80.06,39.24) v1(80.01,30.83) v1(80.37,28.81) v1(80.32,20.55) v1(80.52,23.64) v1(80.83,53.65) v1(80.79,25.59) v1(80.92,21.97) v1(81.22,39.24) v1(81.48,20.55) v1(81.68,23.64) v1(81.75,52.73) v1(81.93,30.31) v1(81.95,25.59) v1(82.08,21.97) v1(82.08,27.34) v1(82.84,23.64) v1(83.1,25.59) v1(83.24,27.34) v1(83.24,21.97) v1(83.42,31.89) v1(84,23.64) v1(84.26,25.59) v1(84.4,27.34) v1(84.62,28.95) v1(84.79,58.38) v1(85.16,59.31) v1(85.16,23.64) v1(85.42,25.59) v1(85.78,28.95) v1(85.98,30.59) v1(86.34,58.19) v1(86.58,25.59) v1(86.94,28.95) v1(87.14,30.59) v1(87.25,42.84) v1(87.41,56.81) v1(87.81,43.71) v1(87.84,32.32) v1(88.3,30.59) v1(88.58,44.83) v1(88.73,55.74) v1(88.99,32.32) v1(89.14,45.9) v1(89.88,30.65) v1(89.96,54.62) v1(90.15,32.32) v1(90.57,53.3) v1(91.04,30.65) v1(91.39,52.33) v1(92.1,32.29) v1(92.26,36.96) v1(92.19,30.65) v1(92.92,50.24) v1(93.26,32.29) v1(93.29,41.98) v1(93.29,40.29) v1(93.39,42.95) v1(93.39,38.76) v1(93.42,36.96) v1(93.68,49.01) v1(94.05,31.05) v1(94.35,48.15) v1(94.34,41.98) v1(94.34,40.29) v1(94.44,42.95) v1(94.44,38.76) v1(94.42,32.29) v1(94.57,36.96) v1(94.83,58.66) v1(95.21,31.05) v1(95.85,57.19) v1(95.85,56.14) v1(95.85,54.98) v1(95.8,46.4) v1(95.8,45.35) v1(95.8,44.2) v1(95.97,53.86) v1(95.97,52.71) v1(96.37,31.05) v1(97.43,54.84) v1(97.43,53.79) v1(97.43,52.64) v1(97.98,37.7) v1(97.99,50.66) v1(97.99,49.61) v1(97.99,48.46) v1(98.05,32.5) v1(98.05,31.45) v1(98.05,30.3) v1(98.2,47.14) v1(98.2,46.09) v1(98.2,44.94) v1(98.47,38.65) v1(98.55,54.13) v1(98.55,53.08) v1(98.55,51.92) v1(98.86,29.14) v1(98.86,28.09) v1(98.86,26.93) v1(98.96,25.06) v1(98.96,24.01) v1(98.96,22.85) v1(99.03,37.7) v1(99.27,47.85) v1(99.27,46.8) v1(99.27,45.65) v1(99.27,20.72) v1(99.27,19.67) v1(99.27,18.52) v1(99.52,38.65) v1(99.98,16.64) v1(99.98,15.59) v1(99.98,14.44) v1(100.18,37.7) v1(100.67,38.65) v1(101.72,15.06) v1(101.72,14.01) v1(101.72,12.86) v1(102.38,58.72) v1(102.38,57.67) v1(102.38,56.51) v1(103.25,49.55) v1(103.36,64.86) v1(103.3,14.7) v1(103.3,13.65) v1(103.3,12.5) v1(103.5,57.65) v1(103.5,56.59) v1(103.5,55.44) v1(103.6,54) v1(103.6,51.98) v1(103.6,50.88) v1(104.06,33.52) v1(104.06,32.47) v1(104.06,31.32) v1(104.22,29.95) v1(104.22,28.9) v1(104.22,27.75) v1(104.62,65.96) v1(104.62,64.91) v1(104.62,63.76) v1(105.13,56.42) v1(105.13,55.37) v1(105.13,54.22) v1(105.24,21.64) v1(105.56,64.57) v1(105.56,63.51) v1(105.56,62.36) v1(105.9,22.29) v1(106.15,21.35) v1(106.51,63.46) v1(106.51,62.41) v1(106.51,61.26) v1(107.43,61.75) v1(107.44,12.36) v1(107.58,62.75) v1(107.58,60.54) v1(108.42,61.81) v1(108.42,60.76) v1(108.42,59.61) v1(108.49,12.36) v1(109.04,38.1) v1(109.37,60.71) v1(109.37,59.65) v1(109.37,58.5) v1(109.37,57.59) v1(109.37,56.54) v1(109.37,55.39) v1(109.35,38.85) v1(109.65,12.36) v1(109.88,54.22) v1(109.93,52.99) v1(110.25,38.62) v1(110.34,55.6) v1(110.34,51.87) v1(110.54,58.87) v1(110.54,57.82) v1(110.54,56.67) v1(111.87,58.77) v1(111.87,57.72) v1(111.87,56.57) v1(112.29,12.26) v1(113.09,58.92) v1(113.09,57.87) v1(113.09,56.72) v1(113.34,12.26) v1(114.42,58.92) v1(114.42,57.87) v1(114.42,56.72) v1(114.49,12.26) v1(115.95,58.82) v1(115.95,57.77) v1(115.95,56.62) v1(116.97,54.27) v1(117.22,58.82) v1(117.22,57.77) v1(117.22,56.62) v1(117.99,20.52) v1(117.99,19.47) v1(117.99,18.31) v1(118.29,57.49) v1(118.29,56.44) v1(118.29,55.29) v1(118.34,30.92) v1(118.34,29.87) v1(118.34,28.72) v1(118.7,54.18) v1(118.7,53.13) v1(118.7,51.97) v1(118.75,50.71) v1(118.75,49.66) v1(118.75,48.51) v1(118.75,22.05) v1(118.75,21) v1(118.75,19.84) v1(118.85,47.19) v1(118.85,46.14) v1(118.85,44.99) v1(118.85,43.21) v1(118.85,42.16) v1(118.85,41.01) v1(118.85,39.23) v1(118.85,38.18) v1(118.85,37.03) v1(118.8,34.39) v1(118.8,33.34) v1(118.8,32.19)
VIN24V: length 6.3
  Top Layer w1.8: 103.46,17.33 107.77,17.33 ; 103.28,17.48 D1.1
CPT_RST: length 20.7
  Top Layer w0.3: FPC1.6 30.37,33.63 32.28,31.72 32.28,28.39
D1+: length 7.4
  Top Layer w0.3: USB7.3 34.17,62.7 34.17,60.7 34.7,60.17 35.15,60.17 35.83,59.49 35.83,58.78 35.07,58.02 35.07,57.68 D7.3
D1-: length 7.3
  Top Layer w0.3: 34.93,60.62 34.63,60.93 34.63,62.7 USB7.2 ; 34.93,60.62 35.34,60.62 36.28,59.68 36.28,58.8 36.96,58.13 36.96,57.66
DISP: length 54.1
  Top Layer w0.3: FPC3.10 77.25,43.42 v1(77.27,43.4) ; R15.2 48.6,19.86 50,18.46 69.11,18.46 74.97,24.33 v1(74.97,26.06) ; v1(74.97,30.14) 77.27,32.44 v1(77.27,39.53)
  Bottom Layer w0.3: v1(77.27,39.53) v1(77.27,43.4) ; v1(74.97,26.06) v1(74.97,30.14)
DTR: length 13
  Top Layer w0.3: v1(21.37,44.47) 21.39,44.47 R22.2 ; Q2.2 21.54,41.43 v1(20.76,40.65) ; 19.25,35.45 20.1,35.45 v1(20.76,36.11)
  Bottom Layer w0.3: v1(21.37,44.47) 20.76,43.86 v1(20.76,40.65) v1(20.76,36.11)
ESP_RST: length 59.9
  Top Layer w0.3: v1(44.37,53.04) 44.32,53.09 44.32,60.64 45.44,61.76 45.44,63.8 45.73,64.09 U5.3 ; R13.2 29.9,54.88 v1(31.31,54.88) ; v1(28.2,50.95) 25.86,48.6 C17.2 19.77,48.47 Q3.3 19.72,46 v1(18.46,46) ; v1(15.4,46.97) 9.96,52.41 H1.5
  Bottom Layer w0.3: v1(18.46,46) 16.37,46 v1(15.4,46.97) ; v1(44.37,53.04) 42.64,53.04 40.8,54.88 v1(31.31,54.88) 31.31,54.06 v1(28.2,50.95)
IO0_G3: length 74.7
  Top Layer w0.3: v1(25.45,42.38) Q2.3 24.73,41.29 R14.2 ; R33.2 v1(55.64,42.53) ; v1(55.64,45.8) v1(53.7,45.8) ; U5.27 60.98,50.12 v1(60.95,50.08) ; H1.6 8.75,54.95 v1(15.2,48.5)
  Bottom Layer w0.3: v1(53.7,45.8) 44.32,45.8 42.84,44.32 27.39,44.32 v1(25.45,42.38) 23.03,44.8 23.03,46.9 21.73,48.2 15.5,48.2 v1(15.2,48.5) ; v1(60.95,50.08) 56.66,45.8 v1(55.64,45.8) 55.64,45.79 v1(55.64,42.53)
IO1_R3: length 33.9
  Top Layer w0.3: FPC3.33 88.75,52.17 79.61,61.3 70.99,61.3 66.94,65.36 U5.39
IO2_R4: length 32.6
  Top Layer w0.3: FPC3.32 88.25,51.8 79.26,60.79 70.64,60.79 67.34,64.09 U5.38
IO3_VSY: length 35.6
  Top Layer w0.3: FPC3.8 76.25,44.78 75.94,44.47 v1(75.94,43.66) ; U5.15 48.76,46.31 51.71,43.35 v1(60.64,43.35)
  Bottom Layer w0.3: v1(60.64,43.35) 73.19,43.35 73.59,43.76 75.84,43.76 v1(75.94,43.66)
IO4_INT: length 30.4
  Top Layer w0.3: v1(42.69,60.44) 40.55,58.29 v1(40.55,54.21) ; v1(28.92,50.39) 28.87,50.34 FPC1.3 ; U5.4 v1(48.35,62.82)
  Bottom Layer w0.3: v1(42.69,60.44) 45.07,62.82 v1(48.35,62.82) ; v1(40.55,54.21) 32.74,54.21 v1(28.92,50.39)
IO5_DE: length 39.8
  Top Layer w0.3: v1(68.65,61.1) 66.05,61.1 v1(65.89,60.95) ; v1(61.46,62.37) 60.23,63.6 51.97,63.6 49.92,61.55 U5.5 ; v1(70.18,55.9) 72.47,53.6 v1(72.47,52.12) ; FPC3.7 75.75,49.05 v1(73.8,51)
  Bottom Layer w0.3: v1(61.46,62.37) 62.88,60.95 v1(65.89,60.95) ; v1(68.65,61.1) 68.65,57.43 v1(70.18,55.9) ; v1(73.8,51) 72.68,52.12 v1(72.47,52.12)
IO6_G3: length 44.3
  Top Layer w0.3: U5.6 50.39,60.28 v1(50.8,59.87) ; FPC3.25 84.75,50.15 v1(84.51,50.39)
  Bottom Layer w0.3: v1(50.8,59.87) 50.8,59.82 52.38,58.24 55.34,58.24 63.41,50.17 82.62,50.17 82.84,50.39 v1(84.51,50.39)
IO7_PCLK: length 32.8
  Top Layer w0.3: L3.2 74.12,54.56 v1(73.29,55.39) ; U5.7 45.85,59.01 v1(45.29,58.45) ; v1(52.38,57.12) v1(59.21,57.12)
  Bottom Layer w0.3: v1(59.21,57.12) 60.13,56.2 67.58,56.2 68.48,55.29 73.2,55.29 v1(73.29,55.39) ; v1(45.29,58.45) 46.61,57.12 v1(52.38,57.12)
IO8_SDA: length 45.9
  Top Layer w0.3: v1(28.3,49.42) 28.37,49.35 FPC1.2 28.37,29.71 29.69,28.39 29.74,28.39 ; U5.12 48.12,52.66 v1(48.5,52.28)
  Bottom Layer w0.3: v1(48.5,52.28) 41.51,52.28 40.24,53.55 34.73,53.55 30.4,49.22 28.51,49.22 v1(28.3,49.42)
IO9_SCL: length 48.1
  Top Layer w0.3: v1(46.46,47.53) 44.93,47.53 v1(42.43,45.03) ; v1(27.39,47.63) 27.79,47.63 27.87,47.55 ; FPC1.1 27.87,47.55 ; 27.87,47.55 27.87,29.87 27.19,29.19 27.19,28.39 ; U5.17 51.3,47.54 v1(51.31,47.53)
  Bottom Layer w0.3: v1(51.31,47.53) v1(46.46,47.53) ; v1(42.43,45.03) 42.38,44.98 33.51,44.98 30.86,47.63 v1(27.39,47.63)
IO10_B7: length 34.4
  Top Layer w0.3: v1(57.99,46) 56.51,47.48 52.94,47.48 52.57,47.85 U5.18 ; FPC3.13 78.75,43.41 77.78,42.43 67.58,42.43 v1(64.01,46)
  Bottom Layer w0.3: v1(64.01,46) v1(57.99,46)
IO14_B3: length 32.5
  Top Layer w0.3: v1(59.87,45.08) 57.65,47.31 U5.22 ; FPC3.17 80.75,42.7 79.92,41.87 67.07,41.87 v1(63.85,45.08)
  Bottom Layer w0.3: v1(63.85,45.08) v1(59.87,45.08)
IO17_B6: length 37.2
  Top Layer w0.3: v1(66.61,54.06) 66.61,52.79 v1(66.66,52.73) ; U5.10 61.75,55.2 v1(62.88,54.06) ; v1(78.67,50.77) 79.25,50.19 79.25,48.02
  Bottom Layer w0.3: v1(66.66,52.73) 76.7,52.73 v1(78.67,50.77) ; v1(66.61,54.06) v1(62.88,54.06)
IO18_B5: length 36.7
  Top Layer w0.3: FPC3.15 79.75,50.56 v1(79.56,50.75) ; U5.11 61.79,53.93 v1(62.37,53.35)
  Bottom Layer w0.3: v1(62.37,53.35) 76.96,53.35 v1(79.56,50.75)
IO21_G7: length 34.3
  Top Layer w0.3: FPC3.21 82.75,45.06 v1(82.52,44.83) ; U5.23 58.92,47.01 65.13,40.8 80.84,40.8 v1(81.37,41.34)
  Bottom Layer w0.3: v1(82.52,44.83) 82.52,42.48 v1(81.37,41.34)
IO38_B4: length 20.7
  Top Layer w0.3: U5.31 69.36,55.2 v1(69.87,54.69) ; v1(80.48,50.85) 80.25,50.62 FPC3.16
  Bottom Layer w0.3: v1(69.87,54.69) 76.64,54.69 v1(80.48,50.85)
IO39_G2: length 26.1
  Top Layer w0.3: U5.32 79.96,56.47 85.25,51.18 FPC3.26
IO40_R7: length 28
  Top Layer w0.3: U5.33 80.02,57.74 86.75,51.01 FPC3.29
IO41_R6: length 29.3
  Top Layer w0.3: U5.34 79.66,59.01 87.25,51.42 FPC3.30
IO42_R5: length 30.5
  Top Layer w0.3: FPC3.31 87.75,51.66 79.13,60.28 U5.35
IO45_G4: length 23.8
  Top Layer w0.3: FPC3.24 v1(84.25,46.67) ; U5.26 63.89,48.87 v1(64.52,48.25)
  Bottom Layer w0.3: v1(64.52,48.25) 66.1,46.67 v1(84.25,46.67)
IO46_HSY: length 34.2
  Top Layer w0.3: U5.16 50.03,46.06 52.12,43.96 v1(59.98,43.96) ; FPC3.9 76.75,44.36 v1(76.65,44.27)
  Bottom Layer w0.3: v1(76.65,44.27) 60.28,44.27 v1(59.98,43.96)
IO47_G6: length 31.6
  Top Layer w0.3: U5.24 60.19,47.79 66.61,41.36 80.07,41.36 83.25,44.54 FPC3.22
IO48_G5: length 26.3
  Top Layer w0.3: FPC3.23 83.75,49.16 v1(83.33,49.57) ; v1(73.85,49.52) 73.8,49.47 67.17,49.47 64.67,46.97 61.86,46.97 61.46,47.38 U5.25
  Bottom Layer w0.3: v1(83.33,49.57) 83.28,49.52 v1(73.85,49.52)
LCD_RST/NC: length 50.2
  Top Layer w0.3: v1(75.25,43.15) FPC3.6 ; R16.2 50.64,19.86 51.53,18.97 68.7,18.97 73.44,23.72 v1(73.44,26.06) ; v1(73.44,30.24) 75.23,32.03 v1(75.23,38.15)
  Bottom Layer w0.3: v1(73.44,30.24) v1(73.44,26.06) ; v1(75.23,38.15) 75.25,38.17 v1(75.25,43.15)
PCLK: length 7.3
  Top Layer w0.3: FPC3.11 77.75,50.06 v1(77.01,50.8) ; v1(76.45,52.02) 75.99,52.48 C19.2 75.59,54.09 L3.1
  Bottom Layer w0.3: v1(76.45,52.02) 76.45,51.36 v1(77.01,50.8)
R: length 20.2
  Top Layer w0.3: D8.2 17.8,50.54 16.68,49.42 16.68,42.35 17.66,41.36 R19.2 17.66,38.67 15.71,36.72 U6.3
R1IN: length 60.8
  Top Layer w0.5: v1(89.28,67.36) 87.34,67.36 ; 110.59,17.48 110.59,21.75 v1(110.47,21.88)
  Bottom Layer w0.5: 100.28,56.67 89.59,67.36 v1(89.28,67.36) ; v1(110.47,21.88) 106.44,25.91 106.44,38.1 101.7,42.84 101.7,55.28 100.3,56.68
R1OUT: length 4.7
  Top Layer w0.3: 87.35,68.59 85.71,68.59 84.36,67.25 83.2,67.25
R2IN: length 54
  Top Layer w0.5: v1(95.53,72.07) 95.18,72.42 92.83,72.42 ; P10.3 113.09,32.41 v1(112.41,33.1)
  Bottom Layer w0.5: v1(95.53,72.07) 95.53,70.49 108.08,57.94 ; v1(112.41,33.1) 108.17,37.33 108.17,57.94
R2OUT: length 3.8
  Top Layer w0.3: 87.11,72.49 87.09,72.47 83.42,72.47 83.34,72.55
RTS: length 10.8
  Top Layer w0.3: R20.2 17.77,43.46 Q3.2 ; v1(17.7,36.98) 17.95,36.72 19.25,36.72
  Bottom Layer w0.3: v1(17.75,44.32) 17.7,44.27 v1(17.7,36.98)
RXD0: length 92.6
  Top Layer w0.3: 74.6,72.39 74.64,72.35 80.39,72.35 80.7,72.66 ; D9.2 v1(24.28,52.38) 25.18,52.38 27.8,54.99 R18.1 29.49,53.35 31.31,53.35 32.05,54.09 v1(32.05,58.95) ; v1(48.76,58.45) 60.13,58.45 63.23,61.55 U5.36 65.54,61.55 v1(65.94,61.96)
  Bottom Layer w0.3: v1(65.94,61.96) 65.94,69.21 67.42,70.68 ; 67.42,70.68 67.38,70.68 ; 67.42,70.68 67.42,70.69 ; 67.42,70.68 72.91,70.68 74.58,72.35 74.58,72.37 ; v1(32.05,58.95) 32.13,59.02 45.49,59.02 45.56,58.95 48.25,58.95 v1(48.76,58.45) ; v1(24.28,52.38) 10.91,52.38 8.41,49.87 H1.4
RXD1: length 45
  Top Layer w0.3: v1(45.09,57.44) 45.37,57.71 47,57.74 ; 47,57.74 62.23,57.74 v1(62.27,57.78) ; 47,57.74 U5.8 ; 74.6,64.74 74.7,64.74 77.17,67.21 80.74,67.21 ; v1(42.21,57.71) 41.72,57.22 41.72,56.35
  Bottom Layer w0.3: 67.79,61.1 67.79,62.49 70.01,64.72 74.51,64.76 ; v1(62.27,57.78) 64.46,57.78 67.78,61.1 ; v1(42.21,57.71) 42.27,57.77 44.77,57.77 v1(45.09,57.44)
SD_CD: length 4.7
  Top Layer w0.3: 25.91,58.6 23.8,58.6 23.05,59.34 23.05,60.87
SD_CS: length 2.8
  Top Layer w0.3: 15.28,60.82 15.28,58.38 15.57,58.09
SD_MISO: length 42.5
  Top Layer w0.3: v1(22.95,58.07) 21.72,58.07 21.71,58.06 ; 21.72,58.02 20.88,58.85 20.88,60.66 ; U5.21 56.38,50.31 v1(53.5,53.19)
  Bottom Layer w0.3: v1(53.5,53.19) 51.71,54.98 43.86,54.98 40.6,58.24 23.12,58.24 v1(22.95,58.07)
SD_MOSI: length 43.7
  Top Layer w0.3: 17.29,58.31 16.44,59.16 16.44,60.82 ; 17.45,58.06 18.47,58.06 18.84,57.69 ; U5.19 53.84,49.89 50.58,53.14 v1(48.86,53.14)
  Bottom Layer w0.3: v1(18.82,57.69) 20.87,55.64 41,55.64 42.99,53.65 48.35,53.65 v1(48.86,53.14)
SD_SCLK: length 42.7
  Top Layer w0.3: 19.98,58.75 19.93,58.75 19.4,59.28 19.03,59.28 18.64,59.67 18.64,60.75 ; U5.20 55.11,49.89 51.8,53.19 v1(51.77,53.19)
  Bottom Layer w0.3: v1(51.77,53.19) 50.59,54.37 43.45,54.37 40.55,57.27 21.46,57.27 v1(19.97,58.76)
SL_D+: length 10.4
  Top Layer w0.3: USB2.8 6.21,31.89 5.92,32.18 5.92,32.59 6.22,32.89 USB2.6 9.33,32.89 10.21,33.77 12.08,33.77 12.49,34.18 U6.5
SL_D-: length 10.1
  Top Layer w0.3: U6.6 12.49,32.91 12.08,33.32 10.4,33.32 9.54,32.46 v1(9.54,32.34) 9.48,32.39 USB2.7 ; v1(8.62,33.44) 8.57,33.39 USB2.5
  Bottom Layer w0.3: v1(8.62,33.44) 9.54,32.52 v1(9.54,32.34)
SW: length 10.7
  Top Layer w0.6: 59.13,23.77 58.86,23.5 D11.1
  Top Layer w0.8: U9.1 61.33,25.97 59.13,23.77
T: length 19.2
  Top Layer w0.3: U6.2 15.3,37.99 16.17,38.86 16.17,49.88 18.67,52.38 D9.1
T1IN: length 9.5
  Top Layer w0.3: 83.19,69.08 84,69.89 87.36,69.89 ; 83.2,69.05 82.36,68.21 82.36,65.91 83.4,64.88
T1OUT: length 62.8
  Top Layer w0.5: 87.36,66.07 88.8,66.07 v1(89.04,65.82) ; v1(107.36,23.05) 111.69,23.05 113.09,21.65 P9.3
  Bottom Layer w0.5: 98.3,56.64 98.36,56.58 ; 98.36,56.58 100.88,54.06 100.88,42.38 105.62,37.64 105.62,24.79 v1(107.36,23.05) ; 98.36,56.58 89.04,65.79 v1(89.04,65.82)
T2IN: length 11.6
  Top Layer w0.3: 81.66,64.5 81.8,64.64 81.8,70.52 82.2,70.91 83.19,70.91 ; 83.33,70.9 83.59,71.16 87.22,71.16
T2OUT: length 51.2
  Top Layer w0.5: 92.83,71.14 94.51,71.14 v1(94.64,71) ; v1(110.57,33.41) 110.59,33.38 110.59,28.19
  Bottom Layer w0.5: 107.33,56.85 94.64,69.54 v1(94.64,71) ; 107.36,56.81 107.36,36.62 v1(110.57,33.41)
TXD0: length 91.4
  Top Layer w0.3: v1(66.5,63.14) 66.18,62.82 U5.37 63.17,62.82 59.42,59.06 49.27,59.06 v1(48.96,59.36) ; D8.1 v1(24.53,50.54) 24.84,50.54 27.03,52.73 31.77,52.73 32.84,53.8 v1(32.84,59.69) ; 74.6,69.81 75.75,70.96 80.76,70.96
  Bottom Layer w0.3: 74.55,69.77 67.6,69.77 ; 67.59,69.78 66.5,68.7 v1(66.5,63.14) ; H1.3 11.16,50.54 v1(24.53,50.54) ; v1(32.84,59.69) 48.63,59.69 v1(48.96,59.36)
TXD1: length 41.2
  Top Layer w0.3: 80.85,69.01 76.23,69.01 74.54,67.32 ; v1(60.69,57.02) 60.14,56.47 U5.9
  Bottom Layer w0.3: 67.88,64.06 67.22,63.39 67.22,61.35 64.62,58.75 62.42,58.75 v1(60.69,57.02) ; 67.88,64.06 67.88,64.07 67.89,64.08 67.89,65.63 69.56,67.3 74.61,67.3 ; 67.88,64.06 67.89,64.07
USB_D+: length 14.5
  Top Layer w0.3: D7.4 35.06,54.7 35.5,54.26 36.41,54.26 40.15,50.53 45.53,50.53 45.94,50.12 U5.14
USB_D-: length 12.5
  Top Layer w0.3: U5.13 45.94,51.39 45.53,50.98 40.47,50.98 36.96,54.49 36.96,55.36
VLED+: length 39.7
  Top Layer w0.3: R31.2 69.63,34.64 v1(72.11,37.13) ; v1(88.79,37.23) 88.84,37.23 91.75,40.14 FPC3.39
  Top Layer w0.8: U9.4 64.83,32.74 R31.2
  Bottom Layer w0.3: v1(72.11,37.13) 88.69,37.13 v1(88.79,37.23)
VLED-: length 41.5
  Top Layer w0.3: FPC3.40 92.25,39.41 79.97,27.13 69.19,27.13 65.93,23.87 L6.2
$9N274640: length 10.1
  Top Layer w0.5: L1.2 109.81,43.26 D2.2
  Top Layer w1: L1.2 112.64,46.06 112.64,48.96
$9N274642: length 3.7
  Top Layer w0.3: R3.1 117.25,49.47 116.74,48.96 115.18,48.96
$9N274647: length 2
  Top Layer w0.4: R1.1 101.03,40.38 D3.1
$9N274649: length 2
  Top Layer w0.3: R2.1 42.26,34.73 D5.1
$9N275850: length 3.3
  Top Layer w0.3: 13.78,35.45 12.02,35.45 C21.1
$9N275879: length 2.4
  Top Layer w0.3: Q2.1 21.59,43.39 R20.1
$9N275880: length 4.6
  Top Layer w0.3: v1(18.92,47.02) 17.79,47.02 Q3.1 ; R22.1 v1(20.86,47.02)
  Bottom Layer w0.3: v1(20.86,47.02) 18.92,47.02
$9N276006: length 1.8
  Top Layer w0.3: R21.2 16.94,23.94 D10.1
$9N276822: length 4.6
  Top Layer w0.3: 92.8,69.9 96.48,69.9 97.11,70.52
$9N276825: length 5.9
  Top Layer w0.3: v1(94.77,64.78) 94.75,64.8 92.85,64.8 ; 97,61.86 96.76,61.86 v1(95.84,62.79)
  Bottom Layer w0.3: v1(95.84,62.79) 95.84,63.71 v1(94.77,64.78)
$9N276826: length 4.3
  Top Layer w0.3: 92.85,67.35 96.82,67.35 97.04,67.12
$9N276827: length 4.3
  Top Layer w0.3: 97.13,68.69 97.06,68.62 92.88,68.62
$9N276828: length 4.1
  Top Layer w0.3: 92.99,63.56 96.76,63.56 97,63.8
$9N276829: length 4.6
  Top Layer w0.3: 92.83,66.09 94.75,66.09 95.54,65.3 97.13,65.3
$9N298193: length 11.5
  Top Layer w0.4: U9.3 65.6,28.85 Q5.3 ; R32.2 v1(59.93,29.19)
  Bottom Layer w0.4: v1(59.93,29.19) v1(65.94,29.19)
$9N298310: length 19.3
  Top Layer w0.3: Q5.1 69.29,32.88 70.74,34.32 v1(70.74,34.78) ; R33.1 61.11,41.04 66.4,35.75 v1(68.19,35.75)
  Bottom Layer w0.3: v1(70.74,34.78) 69.77,35.75 v1(68.19,35.75)

## Copper pours and planes (outline as drawn; the poured copper is in the pictures)
GND on Top Layer: -3.13,74.73 121.62,74.73 121.62,-3.61 -3.13,-3.61
GND on Bottom Layer: -2.77,76.74 123.1,76.74 123.1,-2.06 -2.77,-2.06
VIN24V on Top Layer: 102.55,19.6 108.72,19.6 108.72,17.31 102.55,17.31

Small or netless copper shapes (teardrops, artwork), in the pictures only: 394 on Top Layer, 137 on Bottom Layer

## Text on the board
Top Silkscreen Layer: TX2 | RX1 | RX2 | TX1 | 24V+ | 5V+ | IN | OUT | GND | TX0 | BOOT | RST | RX0 | 5V | 2026-04-12
